# Altium project c-mote.PrjPcb
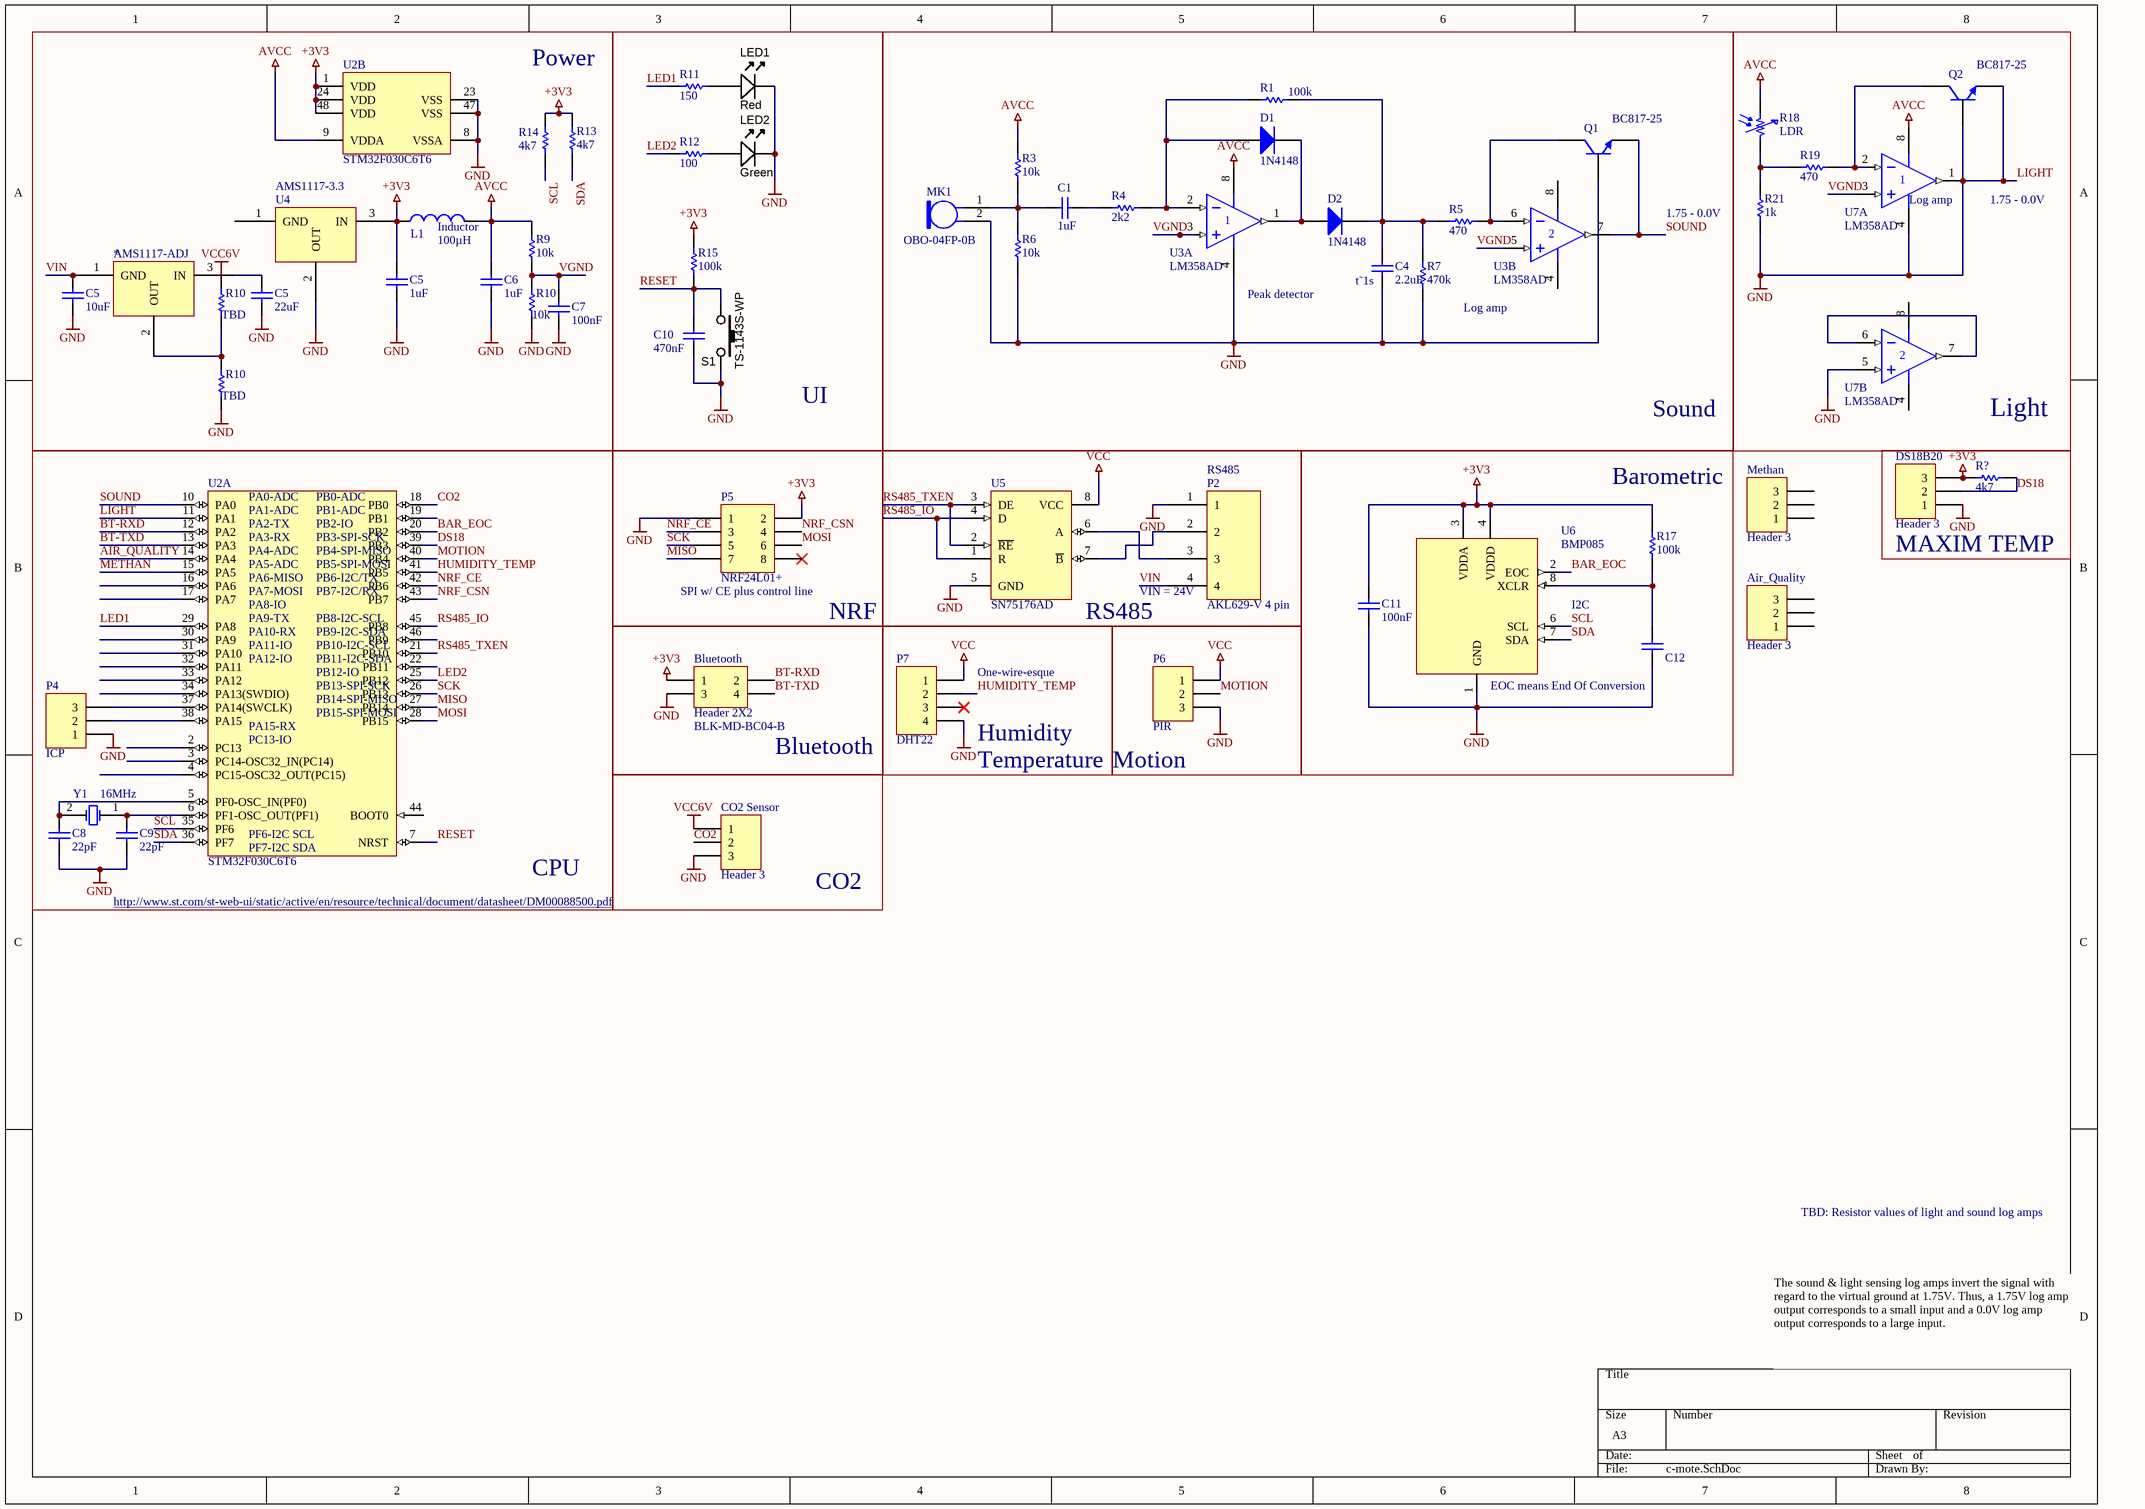
[diagram p0: c-mote.SchDoc]
1 sheet, 60 parts. Net scope: global (net labels, ports and power ports of the same name join across sheets).

## Sheet c-mote.SchDoc
size A3

### Parts
(Parts that share a designator on the sheet are numbered #1, #2 ... from top to bottom, then left to right.)
*  AMS1117-ADJ
Air_Quality  Header 3  [HDR1X3]
Bluetooth  Header 2X2  [HDR2X2]
C1  value 1uF  [CAPC0805(2012)145_M]  (hidden comment: CAP 1uF 10V 0805(2012))
C4  value 2.2uF  [CAPC0805(2012)145_N]  (hidden comment: CAP 2.2uF 10V 0805(2012))
C5#1  value 1uF  [CAPC0805(2012)145_M]  (hidden comment: CAP 1uF 10V 0805(2012))
C5#2  10uF  [CAPC0805(2012)145_M]
C5#3  value 22uF  [CAPC0805(2012)145_M]  (hidden comment: CAP 1uF 10V 0805(2012))
C6  value 1uF  [CAPC0805(2012)145_M]  (hidden comment: CAP 1uF 10V 0805(2012))
C7  value 100nF  [CAPC0805(2012)100_M]  (hidden comment: CAP 100nF 10V 0805(2012))
C8  value 22pF  [CAPC0805(2012)100_M]  (hidden comment: CAP 22pF 10V 0805(2012))
C9  value 22pF  [CAPC0805(2012)100_M]  (hidden comment: CAP 22pF 10V 0805(2012))
C10  value 470nF  [CAPC0805(2012)145_M]  (hidden comment: CAP 470nF 10V 0805(2012))
C11  value 100nF  [CAPC0805(2012)100_M]  (hidden comment: CAP 100nF 10V 0805(2012))
C12  CAP 10nF 10V 0805(2012)  [CAPC0805(2012)100_L]  (value not drawn)
CO2_Sensor  Header 3  [HDR1X3]
D1  1N4148  [SOD-323F]
D2  1N4148  [SOD-323F]
DS18B20  Header 3  [HDR1X3]
L1  Inductor  value 100µH  [INDC3216]
LED1  Color: Red  [LED-0805-K]
LED2  Color: Green  [LED-0805-K]
Methan  Header 3  [HDR1X3]
MK1  OBO-04FP-0B  [OBO-04FP-0B]
P2  AKL629-V 4 pin
P4  ICP  [HDR1X3]
P5  NRF24L01+  [HDR2X4]
P6  PIR  [China-PIR sensor]
P7  DHT22  [DHT22-H]
Q1  BC817-25  [SOT23_N]
Q2  BC817-25  [SOT23_N]
R1  100k  [6-0805]
R3  10k  [6-0805]
R4  2k2  [6-0805]
R5  470  [6-0805]
R6  10k  [6-0805]
R7  470k  [6-0805]
R9  10k  [6-0805]
R10#1  TBD  [6-0805]
R10#2  10k  [6-0805]
R10#3  TBD  [6-0805]
R11  150  [6-0805]
R12  100  [6-0805]
R13  4k7  [6-0805]
R14  4k7  [6-0805]
R15  100k  [6-0805]
R17  100k  [6-0805]
R18  LDR  [KE-10720]
R19  470  [6-0805]
R21  1k  [6-0805]
R?  4k7  [6-0805]
S1  TS-1143S-WP  [TS-1143S]
U2#1  STM32F030C6T6  [STM-LQFP48_N]  (part B of 2)
U2#2  STM32F030C6T6  [STM-LQFP48_N]  (part A of 2)
U3  LM358AD  [SOIC127P600X175-8AN]  (parts A,B of 2)
U4  AMS1117-3.3  [SOT223]
U5  SN75176AD  [SOIC127P600X175-8AN]
U6  BMP085  [BMP085]
U7  LM358AD  [SOIC127P600X175-8AN]  (parts A,B of 2)
Y1  16MHz  [HC49/US]

### Blocks framed on the sheet
Power: * C5#1-C5#3 C6 C7 L1 R9 R10#1-R10#3 R13 R14 U2#1 U4
UI: C10 LED1 LED2 R11 R12 R15 S1
Sound: C1 C4 D1 D2 MK1 Q1 R1 R3-R7 U3
Light: Q2 R18 R19 R21 U7
CPU: C8 C9 P4 U2#2 Y1
NRF: P5
RS485: P2 U5
Barometric: C11 C12 R17 U6
MAXIM TEMP: DS18B20 R?
Motion: P6

### Nets
+3V3: Bluetooth.1 C5#1.2 C11.2 DS18B20.3 L1.1 P5.2 R13.1 R14.1 R15.2 R17.2 R?.2 U2#1.1(VDD) U2#1.24(VDD) U2#1.48(VDD) U4.3(IN) U6.3(VDDA) U6.4(VDDD)
AVCC: C6.2 L1.2 R3.2 R9.2 R18.1 U2#1.9(VDDA) U3.8(V+) U7.8(V+)
LIGHT: Bluetooth.3 C4.1 C5#1.1 C5#2.1 C5#3.1 C6.1 C7.1 C8.1 C9.1 C10.1 C11.1 C12.1 CO2_Sensor.3 DS18B20.1 LED1.K LED2.K MK1.2 P2.1 P4.1 P5.1 P6.3 P7.4 Q1.1(B) Q2.1(B) Q2.2(E) R6.1 R7.2 R10#2.1 R10#3.1 R21.2 S1.2 U2#1.8(VSSA) U2#1.23(VSS) U2#1.47(VSS) U2#2.11(PA1) U3.4(V-) U4.2(OUT) U5.5(GND) U6.1(GND) U7.1(OUT) U7.4(V-) U7.5(IN+)  [also labelled GND]
VCC: P6.1 P7.1 U5.8(VCC)
VCC6V: CO2_Sensor.1 R10#1.2
AIR_QUALITY: U2#2.14(PA4)
BAR_EOC: U2#2.20(PB2) U6.2(EOC)
BT-RXD: Bluetooth.2 U2#2.12(PA2)
BT-TXD: Bluetooth.4 U2#2.13(PA3)
CO2: CO2_Sensor.2 U2#2.18(PB0)
DS18: DS18B20.2 R?.1 U2#2.39(PB3)
HUMIDITY_TEMP: P7.2 U2#2.41(PB5)
LED1: R11.2 U2#2.29(PA8)
LED2: R12.2 U2#2.25(PB12)
METHAN: U2#2.15(PA5)
MISO: P5.7 U2#2.27(PB14)
MOSI: P5.6 U2#2.28(PB15)
MOTION: P6.2 U2#2.40(PB4)
NRF_CE: P5.3 U2#2.42(PB6)
NRF_CSN: P5.4 U2#2.43(PB7)
RESET: C10.2 R15.1 S1.1 U2#2.7(NRST)
RS485_IO: U2#2.45(PB8) U5.1(R) U5.4(D)
RS485_TXEN: U2#2.21(PB10) U5.2(~{RE}) U5.3(DE)
SCK: P5.5 U2#2.26(PB13)
SCL: R14.2 U2#2.35(PF6) U6.6(SCL)
SDA: R13.2 U2#2.36(PF7) U6.7(SDA)
SOUND: Q1.2(E) U2#2.10(PA0) U3.7(OUT)
VGND: C7.2 R9.1 R10#2.2 U3.3(IN+) U3.5(IN+) U7.3(IN+)
VIN: *.1(GND) C5#2.2 P2.4
Net*_2: *.2(OUT) R10#1.1 R10#3.2
Net*_3: *.3(IN) C5#3.2
NetC1_1: C1.1 R4.2
NetC1_2: C1.2 MK1.1 R3.1 R6.2
NetC4_2: C4.2 D2.2(K) R1.1 R5.1 R7.1
NetC8_2: C8.2 U2#2.5(PF0-OSC_IN(PF0)) Y1.2(OSC2)
NetC9_2: C9.2 U2#2.6(PF1-OSC_OUT(PF1)) Y1.1(OSC1)
NetC12_2: C12.2 R17.1 U6.8(XCLR)
NetD1_1: D1.1(A) R1.2 R4.1 U3.2(IN-)
NetD1_2: D1.2(K) D2.1(A) U3.1(OUT)
NetLED1_A: LED1.A R11.1
NetLED2_A: LED2.A R12.1
NetP2_2: P2.2 U5.7(~{B})
NetP2_3: P2.3 U5.6(A)
NetP4_2: P4.2 U2#2.38(PA15)
NetP4_3: P4.3 U2#2.37(PA14(SWCLK))
NetQ1_3: Q1.3(C) R5.2 U3.6(IN-)
NetQ2_3: Q2.3(C) R19.2 U7.2(IN-)
NetR18_2: R18.2 R19.1 R21.1
NetU7_6: U7.6(IN-) U7.7(OUT)

Not connected (* = marked no-connect by the designer): Air_Quality 1 2 3; Methan 1 2 3; P5 8*; P7 3*; U2#2 2(PC13) 3(PC14-OSC32_IN(PC14)) 4(PC15-OSC32_OUT(PC15)) 16(PA6) 17(PA7) 19(PB1) 22(PB11) 30(PA9) 31(PA10) 32(PA11) 33(PA12) 34(PA13(SWDIO)) 44(BOOT0) 46(PB9); U4 1(GND)

### Notes on the sheet
- (near R21) 1.75 - 0.0V
- (near U7) Log amp
- 1.75 - 0.0V
- Peak detector
- (near C4) t˜1s
- Log amp
- (near U2#2) PA0-ADC
- (near U2#2) PA1-ADC
- (near U2#2) PB0-ADC
- (near U2#2) PB1-ADC
- (near P2) RS485
- (near U2#2) PA2-TX
- (near U2#2) PA3-RX
- (near U2#2) PA4-ADC
- (near U2#2) PA5-ADC
- (near U2#2) PA6-MISO
- (near U2#2) PB2-IO
- (near U2#2) PB3-SPI-SCK
- (near U2#2) PB4-SPI-MISO
- (near U2#2) PB5-SPI-MOSI
- (near U2#2) PB6-I2C/TX
- (near U2#2) PA7-MOSI
- (near U2#2) PA9-TX
- (near U2#2) PA8-IO
- (near U2#2) PA10-RX
- (near U2#2) PA11-IO
- (near U2#2) PB7-I2C/RX
- (near U2#2) PB8-I2C-SCL
- (near U2#2) PB9-I2C-SDA
- (near U2#2) PB10-I2C-SCL
- (near P5) SPI w/ CE plus control line
- (near P2) VIN = 24V
- (near U6) I2C
- (near U2#2) PA12-IO
- (near U2#2) PB11-I2C-SDA
- (near U2#2) PB12-IO
- (near U2#2) PB13-SPI-SCK
- (near U2#2) PB14-SPI-MISO
- (near U2#2) PB15-SPI-MOSI
- (near P7) One-wire-esque
- (near U6) EOC means End Of Conversion
- (near U2#2) PA15-RX
- (near U2#2) PC13-IO
- (near Bluetooth) BLK-MD-BC04-B
- Bluetooth
- (near P7) Humidity
- (near P7) Temperature
- (near U2#2) PF6-I2C SCL
- (near U2#2) PF7-I2C SDA
- http://www.st.com/st-web-ui/static/active/en/resource/technical/document/datasheet/DM00088500.pdf
- CO2
- TBD: Resistor values of light and sound log amps
- The sound & light sensing log amps invert the signal with regard to the virtual ground at 1.75V. Thus, a 1.75V log amp output corresponds to a small input and a 0.0V log amp output corresponds to a large input.

### Library data of the parts
* U4 = AMS1117
Air_Quality CO2_Sensor DS18B20 Methan P4 P6 = Header 3: Header, 3-Pin; LatestRevisionDate: 17-Jul-2002; LatestRevisionNote: Re-released for DXP Platform.; Publisher: Altium Limited
Bluetooth = Header 2X2: Header, 2-Pin, Dual row; LatestRevisionDate: 17-Jul-2002; LatestRevisionNote: Re-released for DXP Platform.; Publisher: Altium Limited
C1 C5#1-C5#3 C6 = CMP-1036-04740-1: CAP 1uF 10V ±20% 0805 (2012 Metric) Thickness 1.45mm SMD; Case-Metric: 2012; Case-EIA: 0805; Technology: SMT; Rated Voltage: 10 V; Tolerance: ±20%; Max Thickness: 1.45 mm
  C5#2: Value: 10uF
C4 = CMP-1036-04824-1: CAP 2.2uF 10V ±10% 0805 (2012 Metric) Thickness 1.45mm SMD; Case-Metric: 2012; Case-EIA: 0805; Max Thickness: 1.45 mm; Tolerance: ±10%; Technology: SMT; Rated Voltage: 10 V
C7 C11 = CMP-1036-04394-1: CAP 100nF 10V ±10% 0805 (2012 Metric) Thickness 1mm SMD; Case-EIA: 0805; Case-Metric: 2012; Tolerance: ±10%; Max Thickness: 1 mm; Technology: SMT; Rated Voltage: 10 V
C8 C9 = CMP-1036-01210-1: CAP 22pF 10V ±5% 0805 (2012 Metric) Thickness 1mm SMD; Case-EIA: 0805; Case-Metric: 2012; Max Thickness: 1 mm; Rated Voltage: 10 V; Tolerance: ±5%; Technology: SMT
C10 = CMP-1036-04631-1: CAP 470nF 10V ±10% 0805 (2012 Metric) Thickness 1.45mm SMD; Case-EIA: 0805; Case-Metric: 2012; Max Thickness: 1.45 mm; Rated Voltage: 10 V; Technology: SMT; Tolerance: ±10%
C12 = CMP-1036-03809-1: CAP 10nF 10V ±10% 0805 (2012 Metric) Thickness 1mm SMD; Case-EIA: 0805; Case-Metric: 2012; Rated Voltage: 10 V; Tolerance: ±10%; Value: 10nF; Technology: SMT; Max Thickness: 1 mm
D1 D2 = 1N4148: High Conductance Fast Diode; Published: 8-Jun-2000; LatestRevisionDate: 17-Jul-2002; LatestRevisionNote: Re-released for DXP Platform.; DatasheetDocument: 1997; PackageReference: DO-35; Publisher: Altium Limited; Code_JEDEC: DO-204-AH; ComponentLink1Description: Manufacturer Link; ComponentLink1URL: http://www.fairchildsemi.com/; ComponentLink2Description: Datasheet; ComponentLink2URL: http://www.fairchildsemi.com/ds/1N%2F1N4148.pdf
L1 = Inductor: Code_IEC: 1005; Published: 8-Jun-2000; LatestRevisionDate: 29-May-2009; LatestRevisionNote: IPC-7351 Footprint Added.; PackageReference: 0402-A; Publisher: Altium Limited; PackageDescription: Chip Inductor; Code_JEITA: 0402
LED1 = LED_SMD_Red_0805_6mcd: LED 0805 SMD Red 6mcd 621nm; Manufacturer 1: Lite-On Inc; Manufacturer Part Number 1: LTST-C171EKT; Material: GaAsP on GaP; Ratings: 6 mcd; 621 nm; SCDType: source; Package / Case: 0805; Supplier 1: Digi-Key; Supplier Part Number 1: 160-1422-1-ND; Value: Red
LED2 = LED_SMD_Green_0805_6mcd: LED, 0805 SMD, Green; Manufacturer 1: LITE-ON; Manufacturer Part Number 1: LTST-C171GKT; Material: GaP; Ratings: 6 mcd; 569 nm; SCDType: source; Package / Case: 0805; Supplier 1: Digi-Key; Supplier Part Number 1: 160-1423-1-ND; Value: Green
MK1 = Mic2: Microphone; Published: 24-Mar-1999; LatestRevisionDate: 17-Jul-2002; LatestRevisionNote: Re-released for DXP Platform.; PackageReference: PIN2; Publisher: Altium Limited
P5 = Header 4X2: Header, 4-Pin, Dual row; LatestRevisionDate: 17-Jul-2002; LatestRevisionNote: Re-released for DXP Platform.; Publisher: Altium Limited
P7 = Header 4: Header, 4-Pin; LatestRevisionDate: 17-Jul-2002; LatestRevisionNote: Re-released for DXP Platform.; Publisher: Altium Limited
Q1 Q2 = BC817-25: NPN General Purpose Amplifier; Published: 8-Jun-2000; LatestRevisionDate: 20-Nov-2009; LatestRevisionNote: IPC-7351 Footprint Added.; DatasheetVersion: 1997; PackageVersion: Sep-1998; PackageReference: SOT-23A; Publisher: Altium Limited; PackageDescription: 3-Pin SOT-23 Package 0.95 mm Pitch, 2.3 mm Lead Span; ComponentLink1Description: Manufacturer Link; ComponentLink1URL: http://www.fairchildsemi.com/; ComponentLink2Description: Discontinuation Notice; ComponentLink2URL: http://www.fairchildsemi.com/obsolete/obs.jsp
R1 R3-R7 R9 R10#1-R10#3 R11-R15 R17 R19 R21 R? = ERJ6RB: Precision Thick Film Chip Resistor, 10 Ohm to 1M Ohm Range, 1% and 0.5% Tolerance, 0805 Size, 0.1 W; Published: 17-Dec-2003; LatestRevisionDate: 19-Mar-2004; LatestRevisionNote: Silkscreen size reduced.; PackageDocument: Mar-2003; PackageReference: 6-0805; Publisher: Altium Limited; Code_IPC: 2012 [0805]; ComponentLink1Description: Manufacturer Link; ComponentLink1URL: http://www.panasonic.com/industrial/components/resistive_products.htm; ComponentLink2Description: Datasheet; ComponentLink2URL: http://www.panasonic.com/industrial/components/pdf/AOA0000CE2.pdf
R18 = LDR: KE-10720
S1 = SW_SMD_PB_4.3mm: Switch SMD Tact 4.3mm Stem; Manufacturer 1: Bond-Tact; Manufacturer Part Number 1: TS-1143S-WP-200; SCDType: spec; Package / Case: 6.5x6.5mm; 4.3mm stem
U2#1 U2#2 = CMP-0304-00027-2: ARM Cortex-M0 32-bit MCU, 32 KB Flash, 4 KB Internal RAM, 39 I/Os, 48-pin LQFP, -40 to 85 degC, Tray; Internal RAM Size (kB): 4; Supply Voltage(Vcc) min (V): 2.4; Operating Frequency(F) (Processor speed) (MHz): 48; FLASH Size (Prog) (kB): 32; I/Os (High Current): 39; ComponentLink2URL: http://www.st.com/st-web-ui/static/active/en/resource/technical/document/datasheet/DM00088500.pdf; Mounting Technology: Surface Mount; ComponentLink3URL: http://www.st.com/st-web-ui/static/active/en/resource/technical/document/datasheet/DM00058181.pdf; ComponentLink3Description: Package Specification; ComponentLink1Description: Manufacturer URL; Packing: Tray; PackageVersion: Rev. 6, 06/2013; PartNumber: STM32F030C6T6; Core: ARM Cortex-M0; PackageDescription: 48-Pin Low Profile Quad Flat Package, 7 x 7 mm Body, 0.5 mm Pitch; ComponentLink1URL: http://www.st.com/web/en/home.html; ComponentLink2Description: Datasheet; PackageReference: LQFP48; DatasheetVersion: Rev. 1
U3 U7 = LM358AD: Dual Operational Amplifier; Published: 15-Apr-2002; LatestRevisionDate: 13-Apr-2006; LatestRevisionNote: IPC-7351 Footprint Added.; DatasheetVersion: Aug-1988; PackageVersion: Jan-1998; PackageReference: D008; Publisher: Altium Limited; PackageDescription: 8-Pin Small Outline Integrated Circuit 1.27 mm Pitch; Code_IPC: SOIC127P600-8; ComponentLink1Description: Manufacturer Link; ComponentLink1URL: http://www.ti.com/; ComponentLink2Description: Datasheet; ComponentLink2URL: http://www-s.ti.com/sc/ds/lm358.pdf
U5 = SN75176AD: Differential Bus Transceiver; Note: Receiver Hysteresis of 50mV Typical; Published: 15-May-2002; LatestRevisionDate: 13-Apr-2006; LatestRevisionNote: IPC-7351 Footprint Added.; DatasheetVersion: Aug-1989; PackageVersion: Jan-1998; PackageReference: D008; Publisher: Altium Limited; PackageDescription: 8-Pin Small Outline Integrated Circuit 1.27 mm Pitch; Code_IPC: SOIC127P600-8; ComponentLink1Description: Manufacturer Link; ComponentLink1URL: http://www.ti.com/; ComponentLink2Description: Datasheet; ComponentLink2URL: http://www-s.ti.com/sc/ds/sn75176a.pdf
Y1 = XTAL: Crystal; Published: 8-Jun-2000; LatestRevisionDate: 17-Jul-2002; LatestRevisionNote: Re-released for DXP Platform.; PackageReference: R38; Publisher: Altium Limited; PackageDescription: Crystal, Thru-Hole; 2 Leads; Body 3.1 x 8.2 mm (Dia.xH)